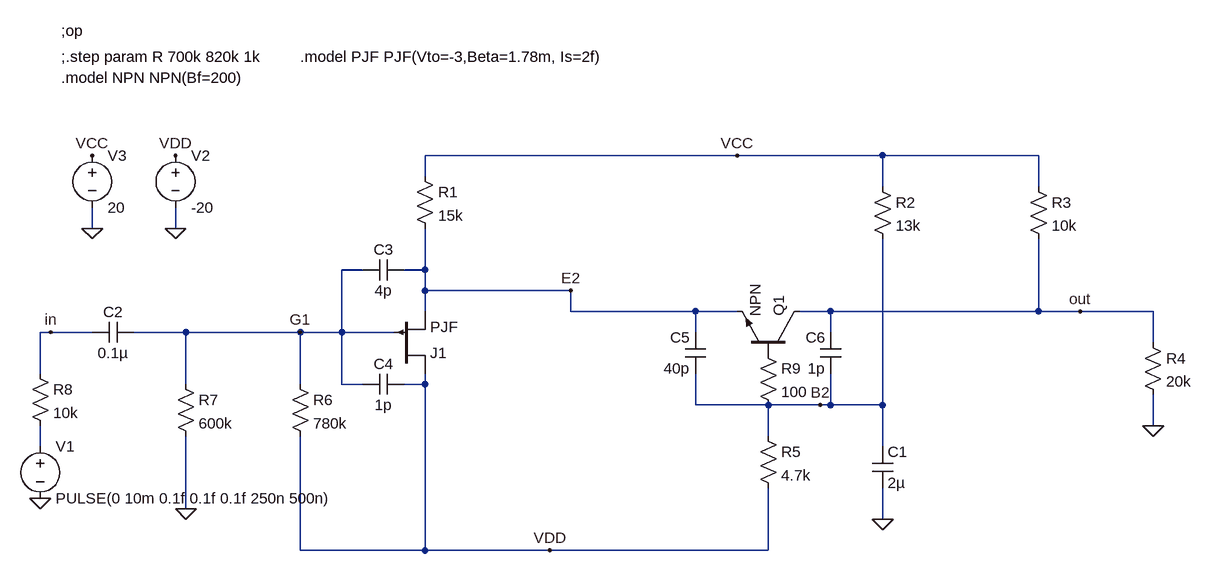
[diagram p0: schematic Simulación.asc]
Simulación.asc, the LTspice schematic file:
Version 4
SHEET 1 964 680
WIRE 256 -80 -224 -80
WIRE 480 -80 256 -80
WIRE 720 -80 480 -80
WIRE -224 -48 -224 -80
WIRE 480 -32 480 -80
WIRE 720 -32 720 -80
WIRE -736 32 -736 0
WIRE -608 32 -608 0
WIRE -320 96 -352 96
WIRE -224 96 -224 32
WIRE -224 96 -256 96
WIRE -224 128 -224 96
WIRE 0 128 -224 128
WIRE -224 160 -224 128
WIRE 0 160 0 128
WIRE 192 160 0 160
WIRE 256 160 192 160
WIRE 400 160 352 160
WIRE 720 160 720 48
WIRE 720 160 400 160
WIRE 784 160 720 160
WIRE 896 160 784 160
WIRE -800 192 -816 192
WIRE -736 192 -800 192
WIRE -592 192 -672 192
WIRE -416 192 -592 192
WIRE -352 192 -352 96
WIRE -352 192 -416 192
WIRE -272 192 -352 192
WIRE 192 192 192 160
WIRE 400 192 400 160
WIRE 896 208 896 160
WIRE -816 256 -816 192
WIRE -592 272 -592 192
WIRE -416 272 -416 192
WIRE -352 272 -352 192
WIRE -320 272 -352 272
WIRE -224 272 -224 256
WIRE -224 272 -256 272
WIRE 192 304 192 256
WIRE 304 304 192 304
WIRE 384 304 304 304
WIRE 400 304 400 256
WIRE 400 304 384 304
WIRE 480 304 480 48
WIRE 480 304 400 304
WIRE 896 336 896 288
WIRE 304 352 304 304
WIRE -816 368 -816 336
WIRE 480 368 480 304
WIRE -592 464 -592 352
WIRE 480 480 480 432
WIRE -416 528 -416 352
WIRE -224 528 -224 272
WIRE -224 528 -416 528
WIRE -32 528 -224 528
WIRE 304 528 304 432
WIRE 304 528 -32 528
FLAG -592 464 0
FLAG -608 32 0
FLAG -736 32 0
FLAG 480 480 0
FLAG 256 -80 VCC
FLAG -32 528 VDD
FLAG -608 -80 VDD
FLAG -736 -80 VCC
FLAG -800 192 in
FLAG -416 192 G1
FLAG 384 304 B2
FLAG 0 128 E2
FLAG -816 448 0
FLAG 896 336 0
FLAG 784 160 out
SYMBOL npn 352 224 M270
SYMATTR InstName Q1
SYMBOL pjf -272 256 M180
SYMATTR InstName J1
SYMBOL res -240 -64 R0
SYMATTR InstName R1
SYMATTR Value 15k
SYMBOL res 464 -48 R0
SYMATTR InstName R2
SYMATTR Value 13k
SYMBOL res 704 -48 R0
SYMATTR InstName R3
SYMATTR Value 10k
SYMBOL res 288 336 R0
SYMATTR InstName R5
SYMATTR Value 4.7k
SYMBOL res -432 256 R0
SYMATTR InstName R6
SYMATTR Value 780k
SYMBOL res -608 256 R0
SYMATTR InstName R7
SYMATTR Value 600k
SYMBOL cap 464 368 R0
SYMATTR InstName C1
SYMATTR Value 2µ
SYMBOL cap -672 176 R90
WINDOW 0 0 32 VBottom 2
WINDOW 3 32 32 VTop 2
SYMATTR InstName C2
SYMATTR Value 0.1µ
SYMBOL voltage -816 352 R0
WINDOW 123 24 124 Left 2
WINDOW 39 0 0 Left 2
SYMATTR InstName V1
SYMATTR Value PULSE(0 10m 0.1f 0.1f 0.1f 250n 500n)
SYMBOL voltage -608 -96 R0
WINDOW 123 0 0 Left 2
WINDOW 39 0 0 Left 2
SYMATTR InstName V2
SYMATTR Value -20
SYMBOL voltage -736 -96 R0
WINDOW 123 0 0 Left 2
WINDOW 39 0 0 Left 2
SYMATTR InstName V3
SYMATTR Value 20
SYMBOL cap -256 80 R90
WINDOW 0 0 32 VBottom 2
WINDOW 3 32 32 VTop 2
SYMATTR InstName C3
SYMATTR Value 4p
SYMBOL cap -256 256 R90
WINDOW 0 0 32 VBottom 2
WINDOW 3 32 32 VTop 2
SYMATTR InstName C4
SYMATTR Value 1p
SYMBOL cap 208 256 R180
WINDOW 0 24 56 Left 2
WINDOW 3 24 8 Left 2
SYMATTR InstName C5
SYMATTR Value 40p
SYMBOL cap 416 256 R180
WINDOW 0 24 56 Left 2
WINDOW 3 24 8 Left 2
SYMATTR InstName C6
SYMATTR Value 1p
SYMBOL res 288 208 R0
SYMATTR InstName R9
SYMATTR Value 100
SYMBOL res 880 192 R0
SYMATTR InstName R4
SYMATTR Value 20k
SYMBOL res -832 240 R0
SYMATTR InstName R8
SYMATTR Value 10k
TEXT -784 -232 Left 2 !;.step param R 700k 820k 1k
TEXT -784 -272 Left 2 !;op
TEXT -784 -200 Left 2 !.model NPN NPN(Bf=200)
TEXT -416 -232 Left 2 !.model PJF PJF(Vto=-3,Beta=1.78m, Is=2f)

The netlist it stands for:
* Simulación.asc
Q1 out P001 E2 0 NPN
J1 VDD G1 E2 PJF
R1 VCC E2 15k
R2 VCC B2 13k
R3 VCC out 10k
R5 B2 VDD 4.7k
R6 G1 VDD 780k
R7 G1 0 600k
C1 B2 0 2µ
C2 G1 in 0.1µ
V1 N001 0 PULSE(0 10m 0.1f 0.1f 0.1f 250n 500n)
V2 VDD 0 -20
V3 VCC 0 20
C3 E2 G1 4p
C4 VDD G1 1p
C5 B2 E2 40p
C6 B2 out 1p
R9 P001 B2 100
R4 out 0 20k
R8 in N001 10k
.model NPN NPN
.model PNP PNP
.lib standard.bjt
.model NJF NJF
.model PJF PJF
.lib standard.jft
;.step param R 700k 820k 1k
;op
.model NPN NPN(Bf=200)
.model PJF PJF(Vto=-3,Beta=1.78m, Is=2f)
.backanno
.end